# EAGLE board Zero_V1.0 (EAGLE 7.7.0)
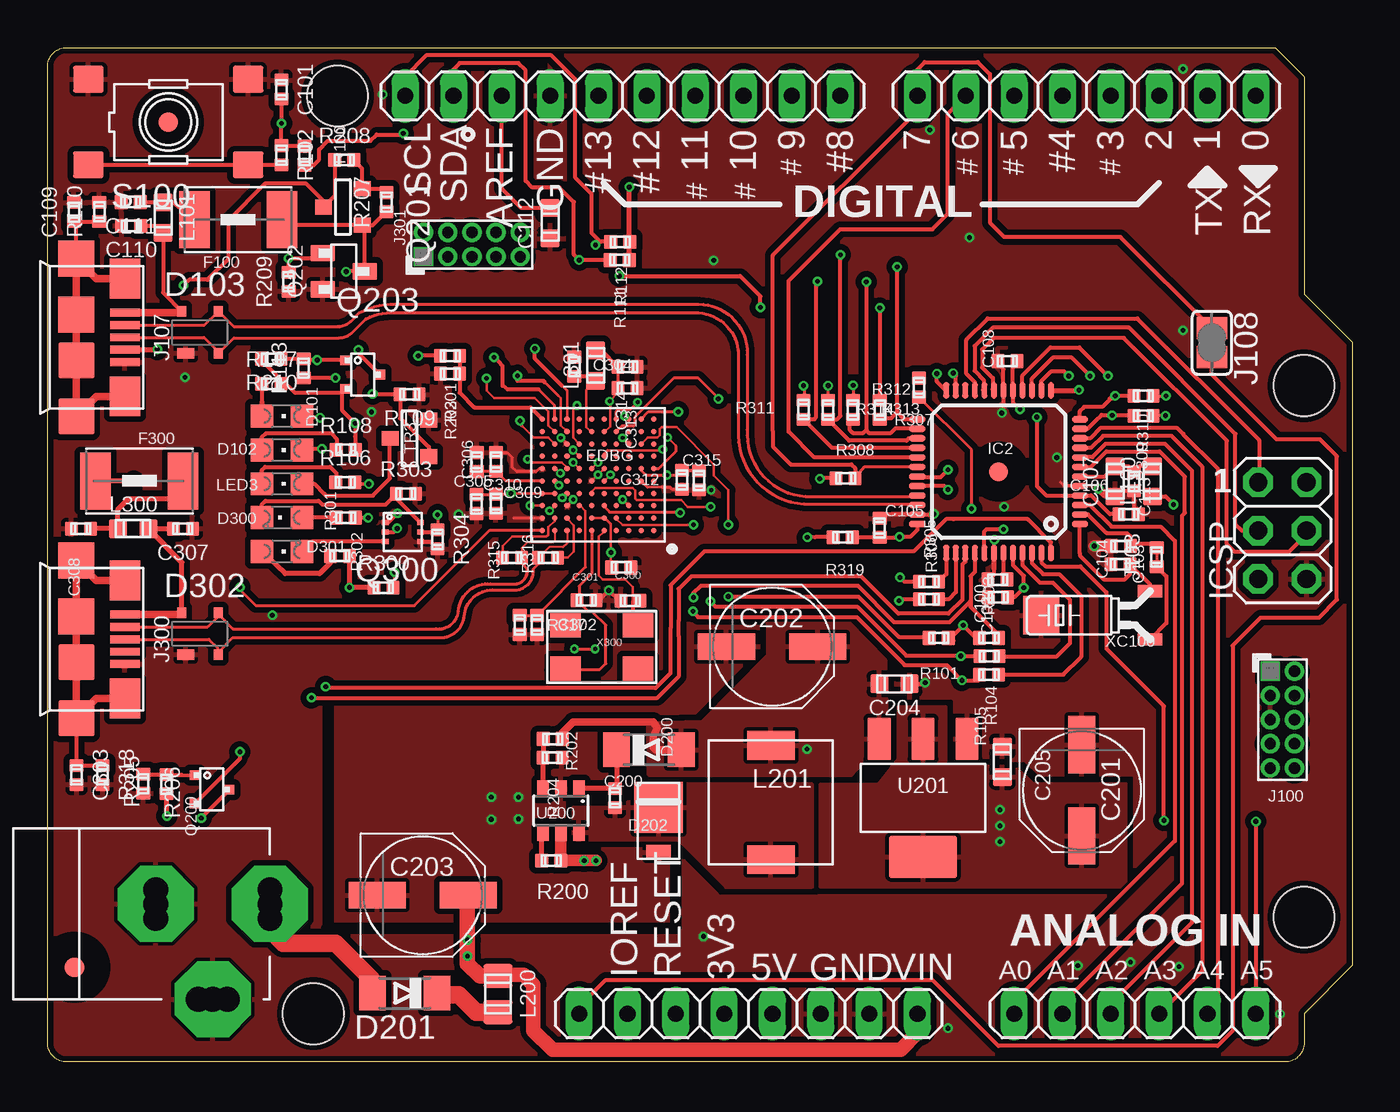
[diagram p3: board, top side]
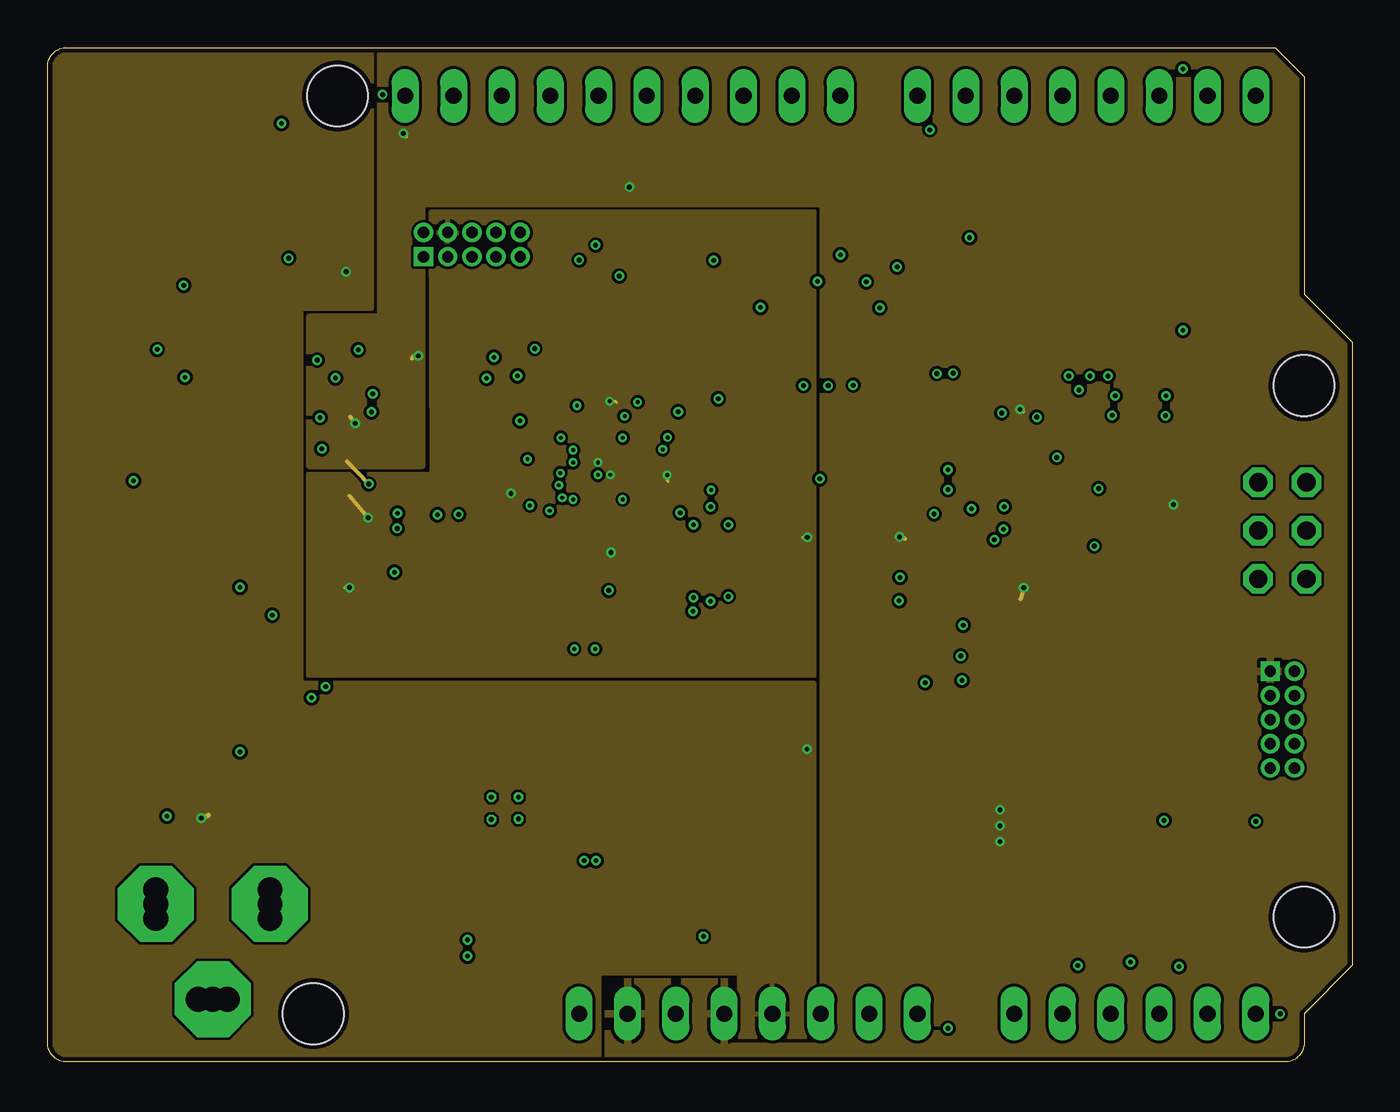
[diagram p4: board, inner layer Power]
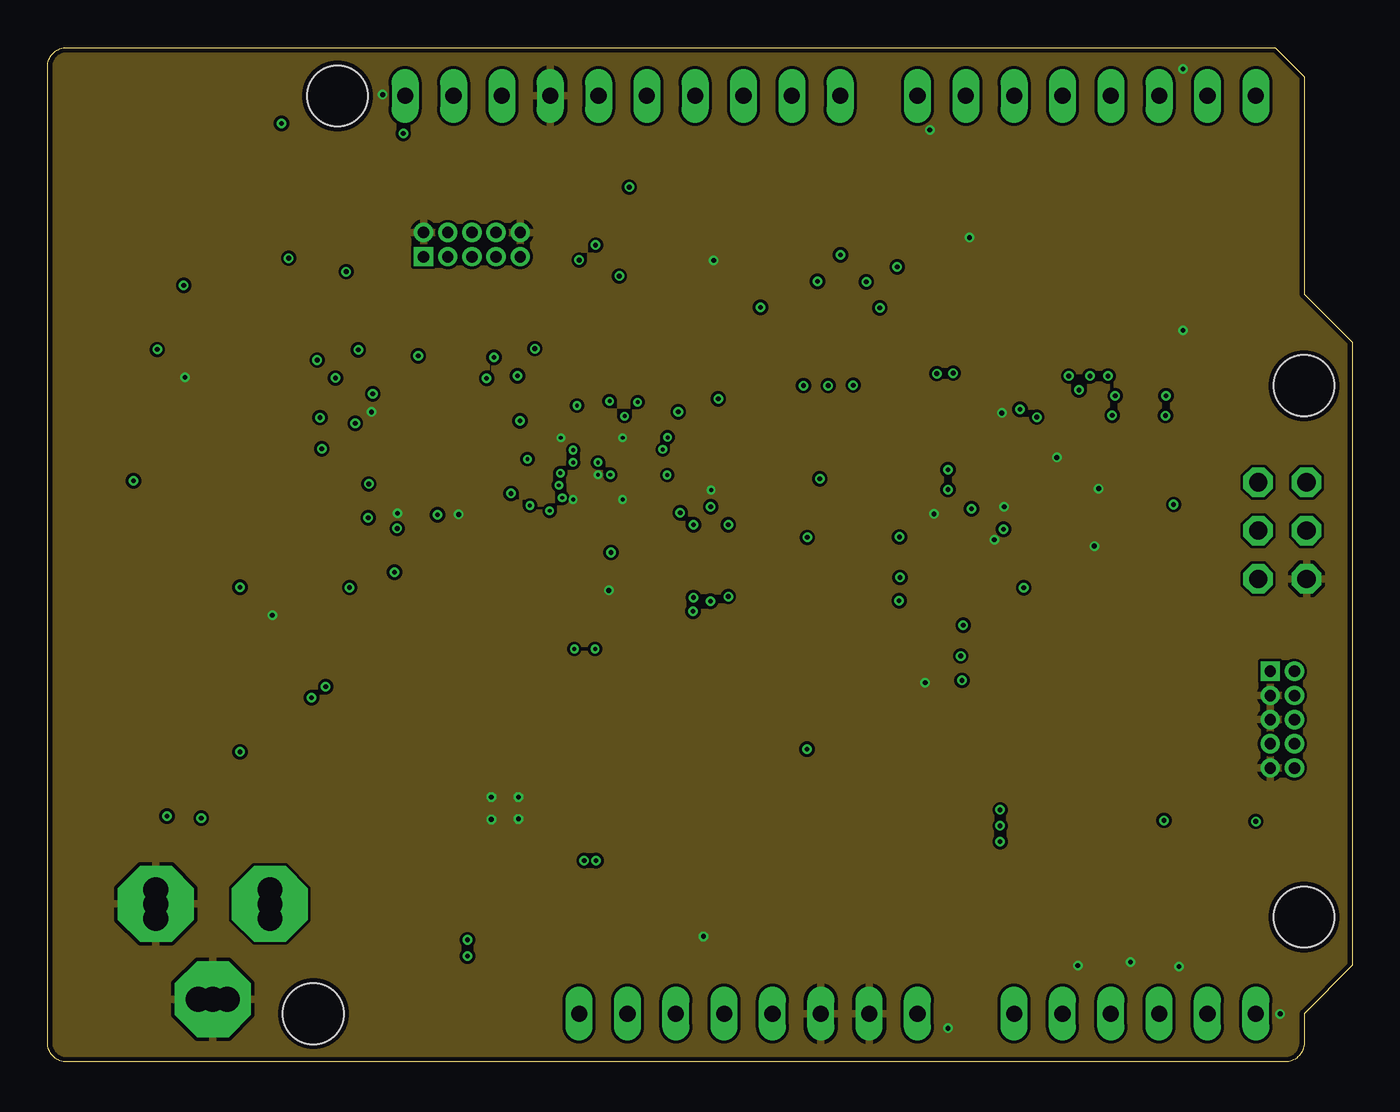
[diagram p5: board, inner layer GND]
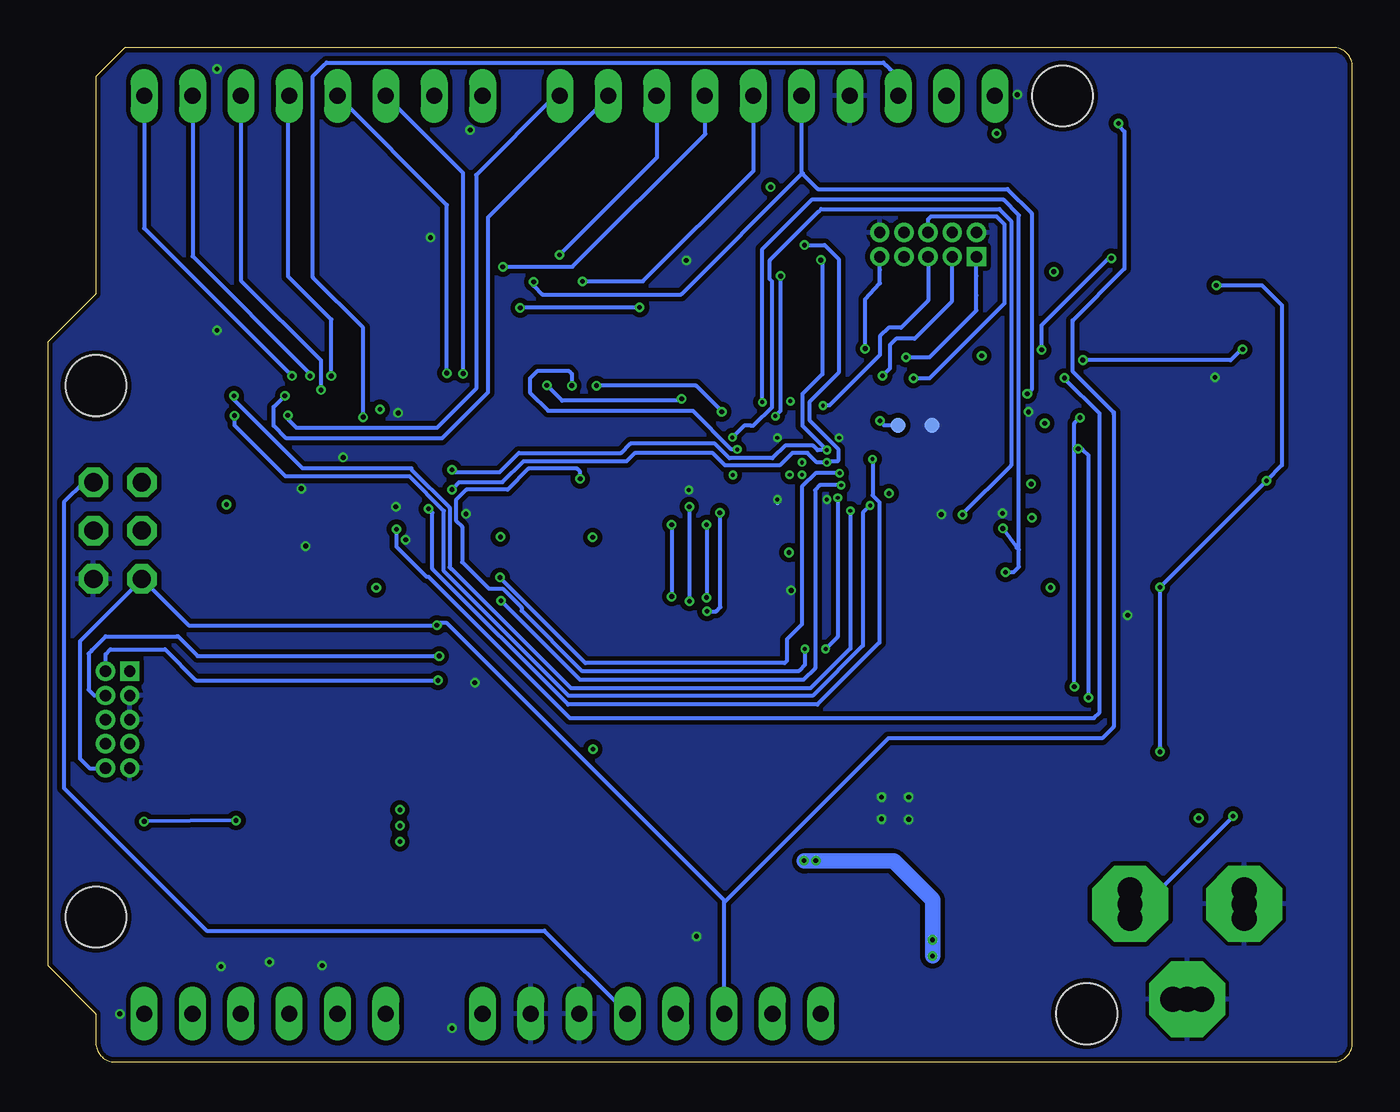
[diagram p6: board, bottom side, seen from below]

Size 68.58 x 53.34 mm. Coordinates in mm from the lower left corner, seen from the top.
Outline: 64.52,53.34 66.04,51.82 66.04,40.39 68.58,37.85 68.58,5.08 66.04,2.54 66.04,1 arc-90 65.04,0 1,0 arc-90 0,1 0,52.34 arc-90 1,53.34 64.52,53.34
Copper layers (1+2*3+16): Top 0.035mm / dielectric 0.36mm / Power 0.035mm / dielectric 0.71mm / Route3 0.035mm / dielectric 0.36mm / Bottom 0.035mm
Design rules "eC_4Layer_PClass6_BaseCopperO35-I35 *": minimum track width 0.1mm, minimum drill 0.2mm, track to track 0.15mm, track to pad 0.15mm, pad to pad 0.15mm, via to via 0.15mm, smd to smd 0mil, copper to edge 0.25mm, drill to drill 0.35mm, minimum pad ring 0.175mm, minimum via ring 0.125mm, stop-mask expansion 0mil, vias tented up to drill 0.45mm, thermal gap 0.2mm
Net classes: 0 default: width 0.102 mm, drill 0.1 mm; 1 USB: width 0.102 mm, drill 0.1 mm; 2 gnd: width 0.102 mm, drill 0.1 mm; 3 usbvcc: width 0.102 mm, drill 0.1 mm, clearance 0.15 mm; 4 USBpair: width 0.102 mm, drill 0.1 mm, clearance 0.15 mm to class 3
Holes 3.2 mm at 66.04,35.56 66.04,7.62 15.24,50.8 13.97,2.54
tKeepout: 2 lines
tRestrict: 3 lines

## Footprints (pad centres in the part's own frame; a part is rotated, then mirrored left to right if it is on the bottom)
C0402 = smd 0.75 x 0.7: 1 0,0.5; 2 0,-0.5
C0603 = smd 1 x 0.95: 1 0,0.8; 2 0,-0.8
PANASONIC_D = smd 3 x 1.4: + 2.4,0; - -2.4,0
CHIPLED_0805 = smd 1.2 x 1.2: A 0,-1.05; C 0,1.05
SOT143B = smd 0.88 x 0.55: 1 -0.75,-1.1 | smd 0.48 x 0.55: 2 0.95,-1.1; 3 0.95,1.1; 4 -0.95,1.1
MINIMELF = smd 1.4 x 1.8: A 1.7,0; C -1.7,0
DO220AAL = smd 2.667 x 2.54: P$1 -0.7,0 | smd 0.762 x 1.27: P$2 1.65,0
VFBGA100 = smd 0.28 x 0.28: A1 -2.925,2.925; A2 -2.275,2.925; A3 -1.625,2.925; A4 -0.975,2.925; A5 -0.325,2.925; A6 0.325,2.925; A7 0.975,2.925; A8 1.625,2.925; A9 2.275,2.925; A10 2.925,2.925; B1 -2.925,2.275; B2 -2.275,2.275; B3 -1.625,2.275; B4 -0.975,2.275; B5 -0.325,2.275; B6 0.325,2.275; B7 0.975,2.275; B8 1.625,2.275; B9 2.275,2.275; B10 2.925,2.275; C1 -2.925,1.625; C2 -2.275,1.625; C3 -1.625,1.625; C4 -0.975,1.625; C5 -0.325,1.625; C6 0.325,1.625; C7 0.975,1.625; C8 1.625,1.625; C9 2.275,1.625; C10 2.925,1.625; D1 -2.925,0.975; D2 -2.275,0.975; D3 -1.625,0.975; D4 -0.975,0.975; D5 -0.325,0.975; D6 0.325,0.975; D7 0.975,0.975; D8 1.625,0.975; D9 2.275,0.975; D10 2.925,0.975; E1 -2.925,0.325; E2 -2.275,0.325; E3 -1.625,0.325; E4 -0.975,0.325; E5 -0.325,0.325; E6 0.325,0.325; E7 0.975,0.325; E8 1.625,0.325; E9 2.275,0.325; E10 2.925,0.325; F1 -2.925,-0.325; F2 -2.275,-0.325; F3 -1.625,-0.325; F4 -0.975,-0.325; F5 -0.325,-0.325; F6 0.325,-0.325; F7 0.975,-0.325; F8 1.625,-0.325; F9 2.275,-0.325; F10 2.925,-0.325; G1 -2.925,-0.975; G2 -2.275,-0.975; G3 -1.625,-0.975; G4 -0.975,-0.975; G5 -0.325,-0.975; G6 0.325,-0.975; G7 0.975,-0.975; G8 1.625,-0.975; G9 2.275,-0.975; G10 2.925,-0.975; H1 -2.925,-1.625; H2 -2.275,-1.625; H3 -1.625,-1.625; H4 -0.975,-1.625; H5 -0.325,-1.625; H6 0.325,-1.625; H7 0.975,-1.625; H8 1.625,-1.625; H9 2.275,-1.625; H10 2.925,-1.625; J1 -2.925,-2.275; J2 -2.275,-2.275; J3 -1.625,-2.275; J4 -0.975,-2.275; J5 -0.325,-2.275; J6 0.325,-2.275; J7 0.975,-2.275; J8 1.625,-2.275; J9 2.275,-2.275; J10 2.925,-2.275; K1 -2.925,-2.925; K2 -2.275,-2.925; K3 -1.625,-2.925; K4 -0.975,-2.925; K5 -0.325,-2.925; K6 0.325,-2.925; K7 0.975,-2.925; K8 1.625,-2.925; K9 2.275,-2.925; K10 2.925,-2.925
WUERTH-ELEKTRONIK_1812 = smd 1.6 x 3: 1 -2.3,0; 2 2.3,0
FIDUCIA-MOUNT = smd 1.016 x 1.016: P$1 0,0
TQFP48 = smd 0.85 x 0.32: 1 -4.275,2.75; 2 -4.275,2.25; 3 -4.275,1.75; 4 -4.275,1.25; 5 -4.275,0.75; 6 -4.275,0.25; 7 -4.275,-0.25; 8 -4.275,-0.75; 9 -4.275,-1.25; 10 -4.275,-1.75; 11 -4.275,-2.25; 12 -4.275,-2.75; 25 4.275,-2.75; 26 4.275,-2.25; 27 4.275,-1.75; 28 4.275,-1.25; 29 4.275,-0.75; 30 4.275,-0.25; 31 4.275,0.25; 32 4.275,0.75; 33 4.275,1.25; 34 4.275,1.75; 35 4.275,2.25; 36 4.275,2.75 | smd 0.32 x 0.85: 13 -2.75,-4.275; 14 -2.25,-4.275; 15 -1.75,-4.275; 16 -1.25,-4.275; 17 -0.75,-4.275; 18 -0.25,-4.275; 19 0.25,-4.275; 20 0.75,-4.275; 21 1.25,-4.275; 22 1.75,-4.275; 23 2.25,-4.275; 24 2.75,-4.275; 37 2.75,4.275; 38 2.25,4.275; 39 1.75,4.275; 40 1.25,4.275; 41 0.75,4.275; 42 0.25,4.275; 43 -0.25,4.275; 44 -0.75,4.275; 45 -1.25,4.275; 46 -1.75,4.275; 47 -2.25,4.275; 48 -2.75,4.275 | smd 1 x 1: P$1 0,0
2X03 = drill 0.95 pad 1.55 octagon: 1 -2.54,-1.27; 2 -2.54,1.27; 3 0,-1.27; 4 0,1.27; 5 2.54,-1.27; 6 2.54,1.27
PINHEAD_2X05_127 = drill 0.6 pad 1.016 square: 1 -0.635,2.54 | drill 0.6 pad 1.016: 2 0.635,2.54; 3 -0.635,1.27; 4 0.635,1.27; 5 -0.635,0; 6 0.635,0; 7 -0.635,-1.27; 8 0.635,-1.27; 9 -0.635,-2.54; 10 0.635,-2.54
1X10 = drill 0.85 pad 1.422 long: 1 -11.43,0; 2 -8.89,0; 3 -6.35,0; 4 -3.81,0; 5 -1.27,0; 6 1.27,0; 7 3.81,0; 8 6.35,0; 9 8.89,0; 10 11.43,0
1X08 = drill 0.85 pad 1.422 long: 1 -8.89,0; 2 -6.35,0; 3 -3.81,0; 4 -1.27,0; 5 1.27,0; 6 3.81,0; 7 6.35,0; 8 8.89,0
1X06 = drill 0.85 pad 1.422 long: 1 -6.35,0; 2 -3.81,0; 3 -1.27,0; 4 1.27,0; 5 3.81,0; 6 6.35,0
USB-MICRO-10103594 = smd 0.4 x 1.6: D+ 0,0; D- -0.65,0; GND 1.3,0; ID 0.65,0; VBUS -1.3,0 | smd 1.9 x 1.9: SHLD1 -1.2,-2.55; SHLD2 1.2,-2.55; SHLD3 -4.15,-2.55; SHLD4 4.15,-2.55 | smd 2.1 x 1.6: SHLD5 3.1,0; SHLD6 -3.1,0
SJ = smd 1.168 x 1.6: 1 -0.762,0; 2 0.762,0
POWERSUPPLY_DC-21MM = drill 1.3 pad 4 octagon: 1 -5.08,-3.353; 2 -0.076,-6.35; 3 -0.076,-0.356 | drill 1.3: 4 -5.08,-4.115; 5 -5.08,-2.591; 6 -0.838,-0.356; 7 0.686,-0.356; 8 -0.838,-6.35; 9 0.686,-6.35
C0805 = smd 1.5 x 1.25: 1 0,0.95; 2 0,-0.95
SRR0604 = smd 1.5 x 2.5: P$1 3,0; P$2 -3,0
SOT323 = smd 0.6 x 0.5: 1 -0.9,0.75; 2 0.9,0; 3 -0.9,-0.75
SOT-23 = smd 0.787 x 0.889: 1 0.025,-1.016; 2 -0.94,1.016; 3 0.991,1.016
SOT23 = smd 1.3 x 0.9: 1 -1.1,0.95; 2 -1.1,-0.95; 3 1.1,0
PWR_SC70-6L2 = smd 0.25 x 0.35: 1 -0.5,-0.925; 2 0,-0.925; 3 0.5,-0.925; 4 0.5,0.925; 5 0,0.925; 6 -0.5,0.925
TS42_4PINS = smd 1.6 x 1.4: 1 -4.2,2.25; 2 4.2,2.25; 3 -4.2,-2.25; 4 4.2,-2.25
TP-SP = smd 0.8 x 0.8 bottom: X 0,0
SOT23-6 = smd 0.6 x 0.9: 1 -0.95,-1.15; 2 0,-1.15; 3 0.95,-1.15; 4 0.95,1.15; 5 0,1.15; 6 -0.95,1.15
SOT223 = smd 2.235 x 1.219: 1 -3.099,2.311; 2 -3.099,0; 3 -3.099,-2.311 | smd 2.2 x 3.6: 4 3.099,0
CRYSTAL-5.4-3.2 = smd 1.6 x 1.3: 1 -1.9,-1.15; 2 1.9,-1.15; 3 1.9,1.15; 4 -1.9,1.15
CRYSTAL_TC26SMD = smd 1.27 x 0.635: 1 0,1.27; 2 0,-1.27 | smd 1.905 x 2.032: P$1 5.715,0

## Placement (x,y rotation side)
C100  100nF  [C0402]  49.96,24.43 270 top
C101  100nF  [C0402]  12.29,51.13 180 top
C102  100nF  [C0402]  49.93,25.37 270 top
C103  6.8pF  [C0402]  56.39,26.16 90 top
C104  6.8pF  [C0402]  56.41,27.13 90 top
C105  100nF  [C0402]  43.74,28.08 180 top
C106  100nF  [C0402]  57.1,30.53 0 top
C107  10uF  [C0603]  56.11,30.53 0 top
C108  100nF  [C0402]  50.44,36.85 90 top
C109  DNP  [C0402]  1.38,44.7 0 top
C110  4.7nF  [C0402]  4.39,43.97 90 top
C111  4.7nF  [C0402]  4.37,45.21 90 top
C112  4.7uF  [C0603]  26.42,44.1 0 top
C113  100nF  [C0402]  56.82,28.8 90 top
C200  10n  [C0402]  29.82,13.88 0 top
C201  10uF  [PANASONIC_D]  54.36,14.28 270 top
C202  47u  [PANASONIC_D]  38.08,21.84 0 top
C203  10uF  [PANASONIC_D]  19.72,8.77 0 top
C204  4.7uF  [C0603]  44.51,19.88 90 top
C205  4.7uF  [C0603]  50.18,15.79 0 top
C300  22pF  [C0402]  30.63,24.26 270 top
C301  22pF  [C0402]  28.32,24.28 90 top
C302  10pF  [C0402]  25.73,22.98 0 top
C303  DNP  [C0402]  1.52,15.09 180 top
C304  100nF  [C0402]  27.68,36.56 180 top
C305  1uF  [C0402]  22.55,31.54 180 top
C306  1nF  [C0402]  23.57,31.55 180 top
C307  1nF  [C0402]  7.11,28.04 90 top
C308  1nF  [C0402]  1.75,28.04 270 top
C309  100nF  [C0402]  22.55,29.34 0 top
C310  1uF  [C0402]  23.56,29.36 0 top
C311  100nF  [C0402]  30.15,26 90 top
C312  100nF  [C0402]  33.35,30.61 0 top
C313  100nF  [C0402]  30.48,35.43 90 top
C314  2.2uF  [C0402]  30.48,36.55 90 top
C315  2.2uF  [C0402]  34.24,30.58 0 top
D101  Yellow  [CHIPLED_0805]  12.32,33.96 270 top
D102  Yellow  [CHIPLED_0805]  12.32,32.18 270 top
D103  PRTR5V0U2XB  [SOT143B]  8.01,38.37 0 top
D200  CD1206-S01575  [MINIMELF]  31.61,16.42 0 top
D201  BYS10-45-E3  [MINIMELF]  18.77,3.62 180 top
D202  SS1P3L  [DO220AAL]  32.11,12.68 270 top
D300  Green  [CHIPLED_0805]  12.32,28.63 90 top
D301  Yellow  [CHIPLED_0805]  12.32,26.85 270 top
D302  PRTR5V0U2XB  [SOT143B]  8.01,22.53 0 top
EDBG  [VFBGA100]  28.93,30.88 180 top
F100  MF-MSMF050-2  [WUERTH-ELEKTRONIK_1812]  10.01,44.29 0 top
F300  [WUERTH-ELEKTRONIK_1812]  4.83,30.56 180 top
FD1  FIDUCIALMOUNT  [FIDUCIA-MOUNT]  6.35,49.41 0 top
FD2  FIDUCIALMOUNT  [FIDUCIA-MOUNT]  1.42,4.98 0 top
IC2  SAMD21G18A-AUT  [TQFP48]  49.99,31.04 180 top
ICSP  3x2 M  [2X03]  64.9,27.94 270 top
J100  PINHEAD-2x5-P1.27  [PINHEAD_2X05_127]  64.9,18 0 top
J101  FH254-110DF08500V  [1X10]  30.23,50.8 180 top
J102  FH254-108DF08500V  [1X08]  54.61,50.8 180 top
J103  [C0402]  58.29,26.54 0 top
J105  FH254-108DF08500V  [1X08]  36.83,2.54 0 top
J106  FH254-106DF08500V  [1X06]  57.15,2.54 0 top
J107  ZX62-AB-5PA  [USB-MICRO-10103594]  4.06,38.1 270 top
J108  [SJ]  61.19,37.82 270 top
J200  POWER-SUPPLY  [POWERSUPPLY_DC-21MM]  5.33,8.38 90 top
J300  ZX62-AB-5PA  [USB-MICRO-10103594]  4.06,22.23 270 top
J301  PINHEAD-2x5-P1.27  [PINHEAD_2X05_127]  22.3,42.98 90 top
L100  BLM18PG471SN1  [C0603]  58.06,30.53 0 top
L101  BLM18PG471SN1  [C0603]  6.07,44.4 180 top
L200  MH2029-300Y  [C0805]  23.67,3.57 180 top
L201  10uH-SRR0604-100ML  [SRR0604]  38.01,13.65 270 top
L300  BLM18PG471SN1  [C0603]  4.5,28.04 270 top
L301  BLM18PG471SN1  [C0603]  28.8,36.63 0 top
LED3  Yellow  [CHIPLED_0805]  12.32,30.4 270 top
Q200  IRLML6402PBF  [SOT323]  8.64,14.33 0 top
Q201  IRLML6402PBF  [SOT-23]  15.52,44.98 270 top
Q202  2N7002  [SOT23]  15.57,41.58 0 top
Q203  IRLML6402PBF  [SOT323]  16.56,36.14 0 top
Q300  2N7002DW-7-FNO_PAD  [PWR_SC70-6L2]  18.67,27.86 270 top
R100  10k  [C0402]  13.51,47.65 0 top
R101  330R  [C0402]  46.84,22.3 90 top
R102  39R  [C0402]  12.29,47.68 180 top
R103  330R  [C0402]  49.48,22.3 270 top
R104  0R  [C0402]  49.5,21.33 270 top
R105  0R  [C0402]  49.48,20.37 90 top
R106  330R  [C0402]  15.64,30.48 270 top
R107  330R  [C0402]  11.76,35.66 270 top
R108  330R  [C0402]  15.67,32.18 270 top
R109  330R  [C0402]  19.02,35.1 90 top
R110  DNP  [C0402]  2.72,44.7 0 top
R111  DNP  [C0402]  30.07,42.16 90 top
R112  DNP  [C0402]  30.1,43.13 90 top
R113  330R  [C0402]  13.46,36.47 0 top
R200  10k  [C0402]  26.47,10.6 270 top
R201  47k  [C0402]  21.16,37.13 270 top
R202  52.3k  [C0402]  26.55,16.98 270 top
R203  47k  [C0402]  21.16,36.2 90 top
R204  10k  [C0402]  26.53,15.99 90 top
R205  100k  [C0402]  6.25,14.6 0 top
R206  100k  [C0402]  5.03,14.63 180 top
R207  1M  [C0402]  17.81,45.21 0 top
R208  DNP  [C0402]  15.6,47.42 270 top
R209  100k  [C0402]  12.67,41.02 0 top
R210  100k  [C0402]  11.76,36.98 90 top
R300  1M  [C0402]  17.65,24.94 270 top
R301  330R  [C0402]  15.67,28.63 90 top
R302  330R  [C0402]  15.37,26.61 90 top
R303  DNP  [C0402]  18.83,29.88 270 top
R304  1M  [C0402]  20.5,27.48 180 top
R305  330R  [C0402]  46.33,25.24 270 top
R306  330R  [C0402]  46.33,24.33 270 top
R307  330R  [C0402]  45.8,35.46 0 top
R308  330R  [C0402]  41.95,30.7 270 top
R309  330R  [C0402]  57.59,33.99 90 top
R310  330R  [C0402]  57.59,35.03 90 top
R311  330R  [C0402]  39.73,34.3 0 top
R312  330R  [C0402]  43.74,34.29 0 top
R313  330R  [C0402]  42.34,34.29 0 top
R314  330R  [C0402]  41.02,34.28 0 top
R315  39R  [C0402]  24.4,26.51 270 top
R316  39R  [C0402]  26.3,26.51 90 top
R317  6.8k  [C0402]  24.82,22.98 180 top
R318  DNP  [C0402]  2.9,15.09 180 top
R319  0R  [C0402]  41.79,27.59 270 top
S100  PUSHBUTTON3  [TS42_4PINS]  6.34,49.42 0 top
TP300  TP_SP  [TP-SP]  22.1,33.49 0 top
TP301  TP_SP  [TP-SP]  23.88,33.49 0 top
TR3  Q100  [SOT-23]  19.02,32.82 270 top
U200  LM2734Y  [SOT23-6]  26.98,13.22 180 top
U201  LDO-TS1117CW-3V3  [SOT223]  46.01,13.89 270 top
U$5  DNP  [FRAME]  -32.23,-4.98 0 top  (outside the outline)
X300  12mHz-12pF-K7  [CRYSTAL-5.4-3.2]  29.13,21.82 0 top
XC100  32.768kHz  [CRYSTAL_TC26SMD]  57.94,23.48 180 top

## Tracks (layer width: path | path; a pad name or v marks a point on that pad's centre or on a via)
+3V3  (via drill 0.25 pad 0.45)
  Top 0.2: C100.1 50.82,24.45
  Top 0.203: C108.2 50.74,36.49 IC2.17 50.74,34.68 v51.1,34.31 | 59.04,29.3 v59.18,29.31 58.76,29.73 L100.2 | R108.1 16.17,32.91 v16.17,33.58 15.47,34.28 15.47,35.2 | 15.66,35.34 Q203.3 15.47,35.2 | R100.2 13.98,47.15 14.28,47.45 14.28,47.98 14.73,48.44 16.97,48.44 17.3,48.77 18.64,48.77 v18.69,48.82 | R201.2 v19.48,37.13 | IC2.36 45.71,27.98 45.34,27.61 v44.78,27.61 44.75,27.58 C105.1 R319.1 | R210.1 11.26,36.66 11.47,36.66 12.26,35.87 R107.1 12.27,35.92 12.98,35.2 15.47,35.2 | 50.82,24.45 v51.31,24.94 51.31,25.56 50.74,26.13 IC2.44 | R106.1 16.17,30.4 v16.88,30.39
  Top 0.254: 30.57,43.1 v30.57,46 | R111.2 30.57,43.1 | 30.57,43.1 R112.2
  Power 0.203: v59.18,29.31 59.11,29.31 59.13,29.29 | v51.31,24.94 51.16,24.36 51.13,24.33 | v16.88,30.39 15.75,31.57 | v16.17,33.58 15.9,33.93 15.95,33.88 | v18.69,48.82 18.85,48.67 | v19.48,37.13 19.28,37.13 19.15,37.01 | v51.1,34.31 51.16,34.31 51.26,34.21 | v44.78,27.61 44.96,27.61 45.06,27.51
  Bottom 0.203: J100.1
  other vias: 50.06,11.58 50.06,12.42 50.06,13.26
  pour Top: 47.19,18.65 44.72,18.65 44.72,15.92 43.67,14.6 40.62,14.57 40.62,9.22 56.38,9.2 56.68,9.2 56.68,14.6 56.4,14.6 51.77,14.62 50.87,15.52 47.22,15.52
  pour Power: 17.52,54.47 17.52,39.17 13.77,39.17 13.77,31.37 19.67,31.37 19.67,45.12 40.77,45.12 40.77,0.82 35.92,0.82 35.92,4.22 29.47,4.22 29.47,-1.23 70.12,-1.23 70.12,54.47
+5V  (via drill 0.25 pad 0.45)
  Top 0.203: Q201.3 17.09,43.99 R207.2 | Q201.3 16.67,43.86 Q202.3 15.72,41.58 v15.7,41.55 | Q201.3 12.61,43.99 F100.2 | 9.45,14.33 9.45,14.2 v8.08,12.83
  Top 0.254: Q200.2 9.45,14.33
  Top 0.406: R202.1 27.05,17.3 27.62,17.87 31.84,17.87 32.04,17.57 31.84,17.12 31.84,16.55 31.98,16.42 D200.A
  Power 0.203: v15.7,41.55 15.54,41.55 15.52,41.58
  Power 0.254: v8.08,12.83 8.43,12.95 8.46,12.98
  Bottom 0.203: ICSP.2 66.67,30.48 67.72,29.44 67.72,14.4 60.22,6.91 42.47,6.91 J105.5
  other vias: 39.92,16.45
  pour Power: 40.27,1.32 36.37,1.32 36.37,4.67 28.97,4.67 28.97,-0.53 -0.93,-0.53 -0.93,54.32 17.02,54.32 17.02,39.62 13.32,39.62 13.32,19.92 40.27,19.92
  pour Top: 31.6,15.13 42.22,15.1 43.57,16.63 44.09,16.61 44.09,17.15 44.02,21.11 42.03,23.15 37.84,23.15 37.89,22.75 37.89,21.36 34.42,17.84 31.57,17.77
ATN
  Top 0.2: 62.28,1.88 62.28,1.64
  Top 0.203: J105.1 27.94,2.92 29.34,4.32 46.51,4.32 49.98,0.85 61.49,0.85 62.28,1.64 | J108.2 61.19,36.14 64.59,32.74 66.88,32.74 67.77,31.85 67.77,24.31 66.83,23.37 63.75,23.37 62.28,21.89 62.28,1.88
BD_N
  Top 0.102: R315.1 24.92,26.53 24.92,27.02 25.22,27.32 26.57,27.32 26.65,27.4 EDBG.A9 | D302.3 8.96,23.55 8.96,23.42
  Top 0.152: 24.94,26.55 R315.1 | 24.9,26.25 25.21,25.93 arc-90 24.66,25.14 23.27,25.14 arc90 21.59,23.7 arc-90 20.41,22.77 9.74,22.77 8.96,23.55 | J300.D- 8.42,22.88 8.96,23.42
  Top 0.203: R315.1 24.9,26.25
BD_P
  Top 0.102: 8.96,21.54 8.96,21.74 | EDBG.A8 27.3,27.27 27.1,27.07 26.37,27.07 R316.1
  Top 0.152: 25.8,26.21 25.53,25.93 arc-90 24.66,24.82 23.52,24.82 arc90 21.89,23.44 arc-90 20.52,22.32 9.74,22.32 8.96,21.54 | J300.D+ 8.47,22.23 8.96,21.74
  Top 0.203: D302.2 8.96,21.54 | R316.1 25.8,26.21
BOOST
  Top 0.254: D200.C 29.91,14.38 C200.1 27.94,14.38 U200.1
DGI_GPIO1
  Top 0.152: IC2.30 42.94,31.29 R308.1
  Top 0.2: 38.12,42.41 45.43,49.72 45.62,49.91 | 38.12,33.17 38.12,32.37 39.07,31.42 42.24,31.42 42.44,31.22 R308.1
  Top 0.203: 38.12,33.17 38.12,42.41 | J108.1 56.39,43.38 50.29,43.38 49.53,44.14 49.53,51.94 48.9,52.58 46.1,52.58 45.63,52.11 45.63,50.89 J102.8 45.72,50.01 45.43,49.72
  Top 0.254: 42.44,30.8 R308.1
DGI_GPIO2  (via drill 0.25 pad 0.45)
  Top 0.203: IC2.11 54.65,33.29 55.09,33.73 55.1,33.73 55.39,34.02 55.94,34.02 v55.96,34.01 55.98,33.98 R309.1
  Bottom 0.203: J101.1 41.88,50.8 46.05,46.63 46.05,35.41 48.11,33.35 55.5,33.35 55.96,33.81 v55.96,34.01
DGI_GPIO3  (via drill 0.25 pad 0.45)
  Top 0.203: IC2.12 54.26,34.22 54.48,34.44 55.42,34.44 55.84,34.86 | R310.1 v56.11,35.03
  Top 0.254: v56.11,35.03 56.01,35.03 55.84,34.86
  Bottom 0.203: J101.2 39.12,50.72 45.44,44.4 45.44,35.2 47.85,32.79 56.03,32.79 56.69,33.45 56.69,34.44 v56.11,35.03
EDBG_ADC0
  Top 0.203: R201.1 R203.2 21.66,35.19 22.43,34.42 25.38,34.42 EDBG.K10
EDBG_FORCE_BOOT  (via drill 0.25 pad 0.45)
  Top 0.125: EDBG.H9 26.32,32.82 25.56,32.82 24.94,33.45
  Top 0.152: v24.83,33.71 24.83,33.56 24.94,33.45
  Bottom 0.203: v24.83,33.71 24.61,33.49 TP301.X
EDBG_JTAG_TCK  (via drill 0.25 pad 0.45)
  Top 0.152: EDBG.K9 26.65,34.52 25.8,35.36
  Top 0.203: 25.8,35.36 24.18,35.36 23.92,35.55 23.92,36.59 23.53,37.05 v23.46,37.05
  Bottom 0.203: 19.76,40.3 19.76,41.34 | 19.76,41.34 J301.1 | 19.76,41.34 19.76,39.52 22.23,37.05 v23.46,37.05
EDBG_JTAG_TDI  (via drill 0.25 pad 0.45)
  Top 0.125: EDBG.K8 27.3,35.29
  Top 0.152: 27.3,35.29 26.66,35.93
  Top 0.203: 27.04,35.55 26.66,35.93 25.61,36.98 v25.61,37.5
  Bottom 0.203: 24.83,42.33 J301.9 24.84,41.65 24.83,40.95 25.61,40.1 v25.61,37.5
EDBG_JTAG_TDO  (via drill 0.25 pad 0.45)
  Top 0.125: 27.23,33.21 26.98,33.47 26.98,34.9
  Top 0.127: 26.85,35.03 26.98,34.9 | 26.98,33.47 EDBG.J8
  Top 0.152: 26.13,35.75 26.85,35.03 | EDBG.J8 27.3,33.21 27.23,33.21 EDBG.J8
  Top 0.203: 26.13,35.75 26.07,35.81 24.7,35.81 24.57,36.01 24.7,36.27 v24.7,36.07
  Bottom 0.203: J301.3 21,42.31 21.06,42.24 21.06,39.97 23.01,38.02 23.98,38.02 24.31,37.7 24.31,36.46 v24.7,36.07
EDBG_JTAG_TMS  (via drill 0.2 pad 0.45)
  Top 0.125: EDBG.H7 27.62,32.82 27.62,34.32 v27.82,34.52
  Bottom 0.203: J301.5 22.29,40.04 23.73,38.61 24.38,38.61 24.83,38.15 24.83,37.18 27.5,34.52 v27.82,34.52
EDBG_RESET_N  (via drill 0.25 pad 0.45)
  Top 0.125: EDBG.J9 26.32,33.47 26.32,34.19 25.61,34.9 23.46,34.9 23.07,35.29 v23.07,35.95
  Bottom 0.203: J301.6 22.3,44.32 22.14,44.47 18.72,44.47 18.29,44.05 18.29,39.88 22.23,35.95 v23.07,35.95
EN
  Top 0.254: R200.2 25.97,12.01 U200.4
FB
  Top 0.254: R202.2 26.05,16.01 R204.1 U200.3
GND  (via drill 0.2 pad 0.4, 0.2 pad 0.45, 0.25, 0.25 pad 0.45)
  Top 0.125: EDBG.E6 v28.93,30.88 EDBG.F5 | 24.5,28.6 EDBG.B10
  Top 0.127: EDBG.C3 v30.23,29.58 | 31.52,30.23 32.3,30.23
  Top 0.152: EDBG.H8 v26.98,32.82 | EDBG.H3 v30.23,32.82 | EDBG.E2 31.52,30.23 | 32.3,30.23 32.7,30.23 32.81,30.11 C312.2 | EDBG.C8 v27.62,29.58 | EDBG.F10 25.84,31.2 25.68,31.04 24.66,31.04 24.43,31.27 24.43,31.78 24.18,32.03 23.59,32.03 C306.2 | IC2.5 53.43,30.29 53.24,30.48 | IC2.42 49.74,27.44 v49.76,27.46 | U201.1 48.23,17.84
  Top 0.2: IC2.35 46.57,28.79 v46.59,28.82 | 49.74,25.62 C102.2
  Top 0.203: C108.1 50.24,36.41 IC2.18 50.24,34.22 | 50.24,34.22 50.24,34.21 | IC2.35 43.94,28.79 C105.2 | C204.2 46.07,19.88 | C300.2 30.04,24.26 v29.5,24.8 28.99,24.28 C301.2 | 49.74,25.95 49.74,25.62 | C113.2 57.1,29.03 C106.2 56.41,30.03 C107.2 56.01,29.83 55.56,29.83 | 50.24,34.22 50.24,34.21 v50.15,34.12 | Q300.1 17.9,28.36 v18.39,28.86 | Q300.4 20.12,27.36 R304.1
  Top 0.254: IC2.18 | IC2.5 | IC2.42 49.74,25.95
  Top 0.406: 55.56,29.83 v55.24,30.15
  Top 0.61: C104.1 55.14,27.13 v55.02,27.13
  Bottom 0.203: v30.23,29.58 30.23,29.38
  other vias: 34.47,6.6 53.05,31.79 46.37,49.01 48.45,43.35 7.22,36 17.03,34.18 46.13,19.94 59.68,38.47 17.61,50.86 21.61,28.79 64.78,2.53 47.33,1.78 50.28,29.2 35.01,42.15 11.81,23.5 24.75,13.93 24.75,12.78 23.32,12.75 23.32,13.93 54.14,5.07 56.92,5.25 59.47,5.02 59.68,52.22 34.88,30.08
  pour Bottom (isolate 0.254, rank 2): -4.42,55.63 72.92,55.63 73.08,-2.64 -4.42,-2.9
  pour Top (isolate 0.305, rank 2): -3.02,55.04 71.88,55.04 71.88,-1.8 -3.02,-1.8
  pour GND: -5.52,-5.85 76.77,-5.85 76.77,56.1 76.77,56.62 -5.52,56.62 -5.52,56.42
MISO  (via drill 0.25 pad 0.45)
  Top 0.152: R311.2 40.02,33.8 | 40.39,41 v40.47,41.05
  Top 0.2: IC2.28 41.24,32.29 R311.2 40.3,33.8 40.39,33.92 40.39,41
  Bottom 0.203: 31.46,50.79 31.48,50.81 J101.5 31.47,50.77 31.47,46.86 37.29,41.05 v40.47,41.05
MOSI  (via drill 0.25 pad 0.45)
  Top 0.2: IC2.25 45.03,33.79 44.65,34.16 | 43.78,33.83 44.32,33.83 44.65,34.16 | 44.65,34.16 v44.65,41.81
  Top 0.203: 43.78,33.83 R312.2
  Bottom 0.203: v44.65,41.81 41,41.81 34.01,48.79 34.01,50.77 J101.4
N$1
  Top 0.203: Q300.6 18.33,29.63 R303.2 17.76,29.31 14.44,29.31 14.25,29.5 11.44,29.5 11.27,29.32 D300.C
N$2
  Top 0.203: 13.73,26.88 13.42,26.88 D301.C 13.89,27.36 Q300.3
N$3
  Top 0.203: 18.03,32.76 TR3.1 18,30.68 17.1,29.78 14.63,29.78 14.54,29.87 | LED3.C 14.01,30.4 14.54,29.87 | 14.54,29.87
N$4
  Top 0.203: 12.27,47.15 R102.1 S100.4 S100.3
N$5
  Top 0.203: R318.2 C303.2 J300.SHLD4
  Top 0.406: J300.SHLD6 2.56,25.33 J300.SHLD3 J300.SHLD1 J300.SHLD2 1.51,18.83 1.89,18.45 | J300.SHLD5 2.56,19.12 1.89,18.45 | 1.89,18.45 J300.SHLD4
N$6
  Top 0.203: R208.1 16.54,46.98 Q201.2 17.59,45.92 R207.1
N$7
  Top 0.203: C110.2 5.7,43.97 L101.1 6.07,40.46 D103.4
  Top 0.406: J107.VBUS 6.99,39.4 D103.4
N$8
  Top 0.914: L200.1 22.52,2.62 21.62,3.52 20.47,3.52 D201.C
N$9  (via drill 0.25 pad 0.45)
  Top 0.152: Q203.2 17.25,36.14
  Top 0.203: R209.1 v12.67,42.27 14.21,42.27 Q202.1 | v16.33,37.44 16.33,37.27 Q203.2
  Bottom 0.203: 12.75,42.27 v12.67,42.27 12.8,42.27 16.33,38.73 v16.33,37.44
N$10
  Top 0.203: 57.28,30.9 C106.1 | L100.1 57.4,31.33 C106.1 | C106.1 56.8,31.33 C107.1 55.56,30.79 IC2.6
N$11
  Top 0.203: J107.SHLD3 1.51,44.06 C109.2 R110.2
  Top 0.406: J107.SHLD6 2.56,41.2 J107.SHLD3 J107.SHLD1 J107.SHLD2 J107.SHLD4 2.56,35 J107.SHLD5
N$12
  Top 0.203: C111.2 L101.2 6.58,45.2 F100.1
N$13
  Top 0.254: F300.1 7.06,30.6 7.06,29.69 6.98,29.62 4.27,29.62 3.7,29.05 L300.2 C308.1
N$18
  Top 0.125: EDBG.B9 26.65,28.45 26.31,28.12 26.31,27.72 26.22,27.62 24.42,27.62 23.92,27.12 23.92,26.53 R315.2
  Top 0.152: 23.93,26.53 R315.2
N$19
  Top 0.125: 27.3,28.58 27.66,28.22 27.66,26.85 27.33,26.52 26.82,26.52
  Top 0.152: EDBG.B8 27.3,28.58 | 26.82,26.52 R316.2
N$20
  Top 0.203: D102.A 11.27,32.85 11.48,33.06 14.9,33.06 15.2,32.76 15.2,32.2 R108.2
N$21
  Top 0.203: R107.2 11.26,34.68
  Top 0.254: 11.26,34.68 D101.A
N$22
  Top 0.203: LED3.A 11.27,31.12 11.44,31.29 14.85,31.29 15.18,30.96 15.18,30.41 R106.2
N$23
  Top 0.125: 28,29.25 28.27,28.98 28.27,26.02
  Top 0.152: EDBG.C7 28,29.25 | R317.2 C302.1 28.27,26.02
N$24
  Top 0.127: C301.1 27.72,24.22
  Top 0.152: 26.51,20.62 29.01,20.62 29.34,20.96 29.34,22.97 28.63,23.67 28.43,23.67 C301.1 27.94,24.37 27.94,25.02 28.6,25.68 EDBG.A6
  Top 0.203: 26.51,20.62 X300.1
N$25
  Top 0.127: 29.25,27.88 29.22,27.88 28.97,27.62 28.97,25.57 29.17,25.37 30.37,25.37 30.76,24.98 30.76,24.59
  Top 0.152: EDBG.A5 29.25,27.88 | 30.76,24.59 30.76,24.2 C300.1 30.89,24.26
  Top 0.203: 30.76,24.2 30.76,23.46 X300.3
N$26
  Top 0.152: EDBG.E10 24.07,30.55 C306.1 C305.1
N$27
  Top 0.125: 28.32,33.37 28.32,35.34
  Top 0.127: 28.55,33.15 28.54,33.15 28.32,33.37 | 28.32,35.34 L301.2
  Top 0.152: EDBG.J6 28.55,33.15
  Top 0.203: C304.1 28.57,36.06 L301.2
N$34  (via drill 0.25 pad 0.45)
  Top 0.152: EDBG.K2 31.2,33.82 31.57,34.19 v33.15,34.19 | R311.1 39.78,34.8 39.78,35.51 v39.73,35.56
  Bottom 0.203: v33.15,34.19 33.15,34.21 34.49,35.56 v39.73,35.56
N$37  (via drill 0.2 pad 0.4, 0.25 pad 0.45)
  Top 0.152: EDBG.K3 30.49,33.8 v30.33,33.96
  Top 0.2: v43.74,39.65 R312.1
  Top 0.203: v30.05,41.33 36.4,41.33 37.46,40.26 v37.46,39.67
  Bottom 0.203: v30.33,33.96 30.05,34.24 v30.05,41.33 | v37.46,39.67 43.71,39.67 v43.74,39.65
N$38  (via drill 0.25 pad 0.45)
  Top 0.152: v35.26,34.87 35.26,34.9 34.19,35.97 32.92,35.97 30.86,33.91 30.86,33.5 30.79,33.43 30.18,33.43 EDBG.J4 | v42.34,35.59 R313.1
  Bottom 0.203: v35.26,34.87 35.36,34.77 41.53,34.77 v42.34,35.59
N$39  (via drill 0.2 pad 0.45, 0.25 pad 0.45)
  Top 0.125: 29.44,32.16 32.28,32.16 v32.33,32.21
  Top 0.152: EDBG.G5 29.25,31.97 29.44,32.16 | R314.1 v41.02,35.55 v41.03,35.56
  Bottom 0.203: v41.03,35.56 v41.02,35.57 41.02,36.17 41.17,36.32 42.85,36.32 43.23,35.94 43.23,35.2 42.27,34.24 34.67,34.24 32.64,32.21 v32.33,32.21
N$40  (via drill 0.2 pad 0.45, 0.25 pad 0.45)
  Top 0.152: EDBG.C9 26.65,29.24 v26.39,28.98 | R310.2 v58.78,35.03
  Bottom 0.203: v26.39,28.98 26.39,21.74 28.47,19.66 41.07,19.66 47.32,25.91 47.33,25.91 47.44,26.02 47.44,29.15 49.46,31.16 49.46,31.22 55.19,31.22 58.78,34.81 v58.78,35.03
N$41  (via drill 0.2 pad 0.45, 0.25 pad 0.45)
  Top 0.125: EDBG.C10 25.36,29.25
  Top 0.152: 25.36,29.25 v25.35,29.26 | v58.76,33.98 R309.2
  Bottom 0.203: v25.35,29.26 25.73,28.88 25.73,21.89 28.37,19.25 41.2,19.25 47.75,25.81 47.75,28.98 49.55,30.79 56.06,30.79 58.76,33.48 v58.76,33.98
N$42  (via drill 0.2 pad 0.45, 0.25 pad 0.45)
  Top 0.152: EDBG.D8 27.28,29.9 v27.05,29.67 | v27.69,21.72 v28.78,21.72
  Top 0.2: R308.2 40.63,30.7 v40.59,30.66
  Bottom 0.203: v40.59,30.66 40.59,31.04 40.74,31.19 43.31,31.19 44.4,30.1 46.57,30.1 47.12,29.55 47.12,28.48 46.79,28.14 46.79,26.29 45.39,24.89 44.66,24.89 43.67,23.9 43.67,23.73 40.51,20.57 29.08,20.57 28.78,20.88 v28.78,21.72 | v27.05,29.67 27.05,22.35 v27.69,21.72
N$43  (via drill 0.2 pad 0.45, 0.25 pad 0.45)
  Top 0.125: 27.3,31.25 27.03,31.52 25.4,31.52 v25.22,31.7
  Top 0.152: EDBG.F8 27.3,31.25 | 45.8,34.85 R307.2 48.56,32.19 v48.56,29.08
  Bottom 0.203: v25.22,31.7 25.22,29.79 24.87,29.44 24.87,22.05 28.12,18.8 41.22,18.8 48.36,25.93 48.36,28.88 v48.56,29.08
N$44  (via drill 0.2 pad 0.45, 0.25 pad 0.45)
  Top 0.152: EDBG.E9 v26.87,30.33
  Top 0.203: R306.2 44.83,24.33 v44.76,24.26
  Bottom 0.203: v44.76,24.26 40.59,20.09 28.85,20.09 28.25,20.7 28.25,30.07 27.99,30.33 v26.87,30.33
N$45  (via drill 0.2 pad 0.45, 0.25 pad 0.45)
  Top 0.152: EDBG.F9 26.71,31.2 v26.95,30.96
  Top 0.203: R305.2 45.04,25.24 v44.81,25.48
  Bottom 0.203: v26.95,30.96 28.22,30.96 28.93,30.25 28.93,23.01 29.72,22.23 29.72,21.11 29.84,20.98 40.31,20.98 v44.81,25.48
N$67
  Top 0.203: R301.1 D300.A
N$68
  Top 0.254: R302.1 14.87,26.25 14.3,25.68 12.49,25.68 D301.A
PA00_XIN32
  Top 0.2: 54.25,26.75 54.25,26.64 | C103.2
  Top 0.203: 54.25,26.75 54.25,28.28 IC2.1 | 54.25,26.64 55.52,25.37 56.62,25.37 56.89,25.65 C103.2 | XC100.2 57.94,25.11 C103.2
PA01_XOUT32
  Top 0.152: 58.07,27.26 J103.1 J103.2
  Top 0.2: 55.6,27.86 55.67,27.8
  Top 0.203: IC2.2 54.68,28.79 55.6,27.86 | 56.92,27.26 C104.2 | 56.92,27.26 58.07,27.26 | J103.2 58.8,25.54 58.8,23.07 XC100.1 | 56.92,27.26 56.92,27.62 56.74,27.8 55.67,27.8
PA02_AIN0
  Top 0.2: 54.71,29.29 54.78,29.29 | 50.82,2.56 J106.1
  Top 0.203: IC2.3 54.71,29.29 | 54.78,29.29 55.92,28.15 58.49,28.15 59.24,27.4 59.24,11.62 50.82,3.2 50.82,2.56
PA03_AREFA  (via drill 0.25 pad 0.45)
  Top 0.2: 55.83,28.8 55.78,28.85
  Top 0.203: 55.78,28.85 54.84,29.79 IC2.4 52.48,29.79 51.99,30.28 v51.99,33.91 | 26.4,44.93 24.87,44.93 23.88,45.92 J101.8 | C113.1 55.83,28.8
  Top 0.254: 26.4,44.93 C112.1
  Bottom 0.203: J101.8 23.88,51.77 24.3,52.19 | 24.3,52.19 24.51,52.4 | v51.99,33.91 51.99,38.61 54.63,41.25 54.63,51.84 54.08,52.4 54.07,52.4 53.92,52.55 24.66,52.55 24.3,52.19
PA04_AIN4
  Top 0.203: 58.55,2.54 J106.4 60.68,4.8 60.68,31.32 59.08,32.92 55.47,32.92 54.84,32.28 IC2.9 54.29,32.26
PA05_AIN5
  Top 0.203: 54.28,32.77 IC2.10 54.79,32.79 55.32,33.32 59.38,33.32 59.69,33.02 59.69,32.99 61.52,31.17 61.52,3.48 60.96,2.92 J106.5
PA08_TCC0-W0  (via drill 0.25 pad 0.45)
  Top 0.203: IC2.23 47.74,36.08 v47.6,36.22
  Bottom 0.203: v47.6,36.22 47.6,45.06 J102.5
PA09_TCC0-W1  (via drill 0.25 pad 0.45)
  Top 0.203: IC2.14 52.24,35.8 52.76,36.32 53.42,36.32 v53.67,36.07
  Bottom 0.203: v53.67,36.07 53.67,39.04 55.93,41.3 55.93,50.75 J102.4
PA10_TCC0-W2  (via drill 0.25 pad 0.45)
  Top 0.203: IC2.15 51.74,35.94 52.86,37.06 53.8,37.06 v54.79,36.07
  Bottom 0.203: J102.2 60.96,42.37 54.79,36.2 v54.79,36.07
PA11_TCC0-W3  (via drill 0.25 pad 0.45)
  Top 0.203: IC2.16 51.23,36.09 52.7,37.57 54.23,37.57 v55.73,36.07
  Bottom 0.203: J102.1 63.5,43.84 v55.73,36.07
PA14_TCC0-W4  (via drill 0.25 pad 0.45)
  Top 0.203: 54.19,35.31 v54.2,35.33
  Top 0.254: IC2.13 54.2,35.31 v54.2,35.33
  Bottom 0.203: v54.2,35.33 54.2,36.88 58.42,41.1 J102.3
PA15_TCC0-W5  (via drill 0.25 pad 0.45)
  Top 0.203: IC2.24 47.21,35.31 46.74,35.79 v46.74,36.2
  Bottom 0.203: v46.74,36.2 46.74,46.74 J102.6
PA20_TCC0-W6
  Top 0.2: 47.32,49.86 47.32,44.6 46.51,43.79 41.66,43.79 38.94,41.08 38.94,33.15 40.3,31.79 IC2.29
  Top 0.203: 47.32,49.86 J102.7
  Top 0.254: 48.23,50.77 J102.7
PA27_TX_LED  (via drill 0.25 pad 0.45)
  Top 0.2: 33.17,22.4 33.17,23.2 33.17,23.21 | 48.09,26.17 48.13,26.21
  Top 0.203: IC2.39 48.24,26.32 48.13,26.21 | 33.17,22.4 33.17,20.27 32.05,19.15 v13.87,19.15 | 48.09,26.17 48.09,24.33 47.34,23.57 44.72,23.57 42.74,25.55 33.84,25.55 33.17,24.87 33.17,23.21 | v14.42,32.24 13.37,32.24 D102.C
  Bottom 0.203: v14.42,32.24 14.2,32.21 13.87,31.88 v13.87,19.15
PA28_USB_HOST_EN  (via drill 0.25 pad 0.45)
  Top 0.203: R113.2 v15.13,35.97 v15.14,35.97 | IC2.41 49.24,27.9 49.35,28.02 v50.24,28.02
  Bottom 0.203: v15.14,35.97 15.14,35.94 13.28,34.09 13.28,18.39 13.59,18.09 41.12,18.09 48.56,25.52 48.67,25.52 50.24,27.1 v50.24,28.02
PA30_SWCLK
  Top 0.2: R104.1 53.05,21.33 53.74,22.02 | 53.74,24.13 53.75,24.13
  Top 0.203: IC2.45 51.24,26.13 52.17,25.2 52.85,25.2 53.75,24.3 53.75,24.13 | 53.74,22.02 53.74,24.13
PA31_SWDIO
  Top 0.2: IC2.46 51.74,26.23 52.32,25.65
  Top 0.203: 50.01,20.09 R105.2 53.39,20.37 54.32,21.3 | 52.32,25.65 53.17,25.65 54.32,24.5 54.32,21.3 | 54.32,21.3
PB02_AIN10  (via drill 0.25 pad 0.45)
  Top 0.203: v63.5,12.65 J106.6 | v58.67,12.7 58.67,18.72 55.65,21.74 55.65,24.69 54.28,26.06 52.45,26.06 52.24,26.28 IC2.47
  Bottom 0.203: v58.67,12.7 v63.5,12.65
PB03_RX_LED  (via drill 0.25 pad 0.45)
  Top 0.2: 47.62,28.55 47.22,28.55 45.52,26.85 34.52,26.85 | 32.74,22.81 32.74,25.07
  Top 0.203: IC2.48 52.74,27.33 51.51,28.55 47.62,28.55 | 32.74,22.81 32.74,20.45 31.95,19.66 14.7,19.66 v14.62,19.74 | 34.52,26.85 32.74,25.07 | v14.32,33.88 13.37,33.88 D101.C
  Bottom 0.203: v14.62,19.74 14.62,33.58 v14.32,33.88
PB08_AIN2
  Top 0.2: 59.77,30.78 59.61,30.94 | J106.2
  Top 0.203: 59.61,30.94 58.45,32.11 55.65,32.11 54.84,31.29 IC2.7 54.28,31.27 | 59.77,30.78 59.77,28.87 59.61,28.72 59.61,9.37 53.34,3.1 J106.2
PB09_AIN3
  Top 0.2: 55.89,2.55 J106.3
  Top 0.203: IC2.8 54.27,31.8 54.91,31.8 55.63,32.51 58.73,32.51 60.15,31.09 60.15,7.33 55.89,3.07 55.89,2.55
  Top 0.254: 55.93,2.59 J106.3
PB10_S4_SPI_MOSI
  Top 0.203: 66.17,27.76 65.23,26.82 62.38,26.82 61.98,27.23 61.98,32.66 56.57,38.07 49.73,38.07 49.12,37.46 49.12,36.52 49.68,35.96 49.68,35.37
  Top 0.254: ICSP.4 66.17,27.76 | 49.68,35.37 IC2.19
PB11_S4_SPI_SCK
  Top 0.203: ICSP.3 62.76,27.94 62.43,28.27 62.43,33.02 56.85,38.61 49.68,38.61 48.72,37.64 48.72,36.35 49.2,35.86 49.2,35.35
  Top 0.254: 49.2,35.35 IC2.20
PB12_S4_SPI_MISO
  Top 0.203: IC2.21 48.74,35.74 48.28,36.19 48.28,37.97 49.4,39.09 57.28,39.09 63.68,32.69 63.68,30.53
  Top 0.254: 63.68,30.53 ICSP.1
POWER_LED_CTRL  (via drill 0.2 pad 0.4, 0.25 pad 0.45)
  Top 0.152: 18.24,25.03 v18.24,25.76 | EDBG.K4 29.9,34.19 30.05,34.34 30.66,34.34 v31.01,34.7
  Top 0.203: 18.24,25.03 R300.1 | Q300.2 18.18,27.86 v18.38,28.06
  Bottom 0.203: v18.24,25.76 17.8,25.76 17.53,26.04 17.53,26.92 | 17.53,26.92 17.53,44.53 18.34,45.34 28.42,45.34 31.01,42.75 v31.01,34.7 | v18.38,28.06 17.65,27.05 17.53,26.92
RXD
  Top 0.203: IC2.38 47.74,24.71 47.36,24.33 R306.1
SAMD21_RESET  (via drill 0.25 pad 0.45)
  Top 0.125: EDBG.B4 29.9,28.54 30.22,28.22 33.92,28.22 v33.94,28.25
  Top 0.2: 44.49,23.12 47.39,23.12 48.51,24.25 48.51,23.93 | 49.97,22.47 49.97,22.3 R103.1
  Top 0.203: IC2.40 48.74,25.77 48.51,25.55 48.51,24.25 | 44.49,23.12 42.57,25.05 34.34,25.05 33.94,24.65 v33.94,24.42 | 49.97,22.47 48.51,23.93
  Bottom 0.203: v33.94,28.25 v33.94,24.42
SCK  (via drill 0.25 pad 0.45)
  Top 0.2: 42.17,33.77 42.17,33.22 42.32,33.07 42.87,33.07 43.02,33.22 | 45.68,33.32 44.57,33.32 44.32,33.07 43.17,33.07 43.02,33.22 | v43.02,41.02 43.02,33.22
  Top 0.203: v17.09,35.13 18.5,35.13 R109.1 18.52,33.85 20.04,32.33 TR3.3 | 42.17,33.77 R313.2 | 45.68,33.32 IC2.26 | v43.02,41.02 v43.03,41.02
  Top 0.254: 45.7,33.28 IC2.26 | 42.44,33.78 R313.2
  Bottom 0.203: J101.6 28.96,46.79 | 28.96,46.79 28.88,46.71 28.88,46.68 28.09,45.9 18.14,45.9 16.87,44.63 16.87,35.35 v17.09,35.13 | 28.96,46.79 28.96,46.68 35.28,40.36 42.57,40.36 43.03,40.82 v43.03,41.02
SCL  (via drill 0.2 pad 0.45, 0.25 pad 0.45)
  Top 0.125: EDBG.F7 v27.62,31.53
  Top 0.203: v47.32,30.1 47.12,30.29 IC2.32 | R112.1 29.06,43.13 | 29.06,43.13 28.57,43.61 28.57,45.67 27.71,46.53 27.71,51.69 26.44,52.96 19.94,52.96 18.8,51.82 J101.10 | 29.06,43.13 28.98,43.13 v28.8,42.95
  Bottom 0.203: v47.32,30.1 46.93,30.48 44.67,30.48 43.56,31.6 38.15,31.6 37.73,32.02 33.62,32.02 32.97,31.37 30.1,31.37 29.44,32.03 28.65,32.03 28.14,31.53 v27.62,31.53 27.58,31.57 27.08,31.57 27.03,31.62 27.03,32.23 28.4,33.6 28.52,33.72 28.52,34.73 27,36.25 27,42.21 27.74,42.95 v28.8,42.95
SDA  (via drill 0.2 pad 0.45, 0.25, 0.25 pad 0.45)
  Top 0.125: EDBG.G7 v27.62,32.17
  Top 0.2: 25.12,52.09 25.12,52.15 24.74,52.52
  Top 0.203: IC2.31 45.76,30.75 46.93,30.75 v47.32,31.14 | R111.1 28,42.16 v27.94,42.16 27.66,42.44 27.66,45.21 26.9,45.97 25.48,45.97 25.12,46.33 25.12,52.09 | 24.74,52.52 21.66,52.52 21.34,52.2 J101.9
  Bottom 0.203: v47.32,31.14 47.19,31.01 44.84,31.01 43.81,32.03 38.43,32.03 37.95,32.51 33.5,32.51 32.74,31.75 30.48,31.75 29.82,32.41 28.35,32.41 28.11,32.17 v27.62,32.17 28.91,33.45 28.91,35.13 27.86,36.17 27.86,42.09 v27.94,42.16
SS  (via drill 0.25 pad 0.45)
  Top 0.2: v41.67,42.44 41.67,33.97 41.48,33.78 R314.2 42.13,32.67 45.14,32.67 45.26,32.79 IC2.27
  Bottom 0.203: J101.3 36.55,50.77 36.55,47.56 v41.67,42.44
STATUS_LED_CTRL  (via drill 0.2 pad 0.45, 0.25 pad 0.45)
  Top 0.125: 33.02,32.38 33.02,32.41 v32.59,32.84
  Top 0.152: EDBG.F1 32.11,31.2 33.02,32.11 33.02,32.38 | v20.5,28.78 R304.2
  Top 0.203: Q300.5 20.38,27.86 R304.2
  Bottom 0.203: 31.6,33.45 31.98,33.45 v32.59,32.84 | v20.5,28.78 20.5,28.8 17.93,31.37 17.93,44.22 18.56,44.85 27.92,44.85 28.04,44.73 30.62,42.15 30.62,41.15 30.5,41.03 30.5,34.44 31.5,33.45 | 31.6,33.45 31.59,33.45 | 31.6,33.45 31.5,33.45 | 31.5,33.45 31.49,33.45
SW
  pour Top: 40.14,14.6 30.77,14.6 30.74,14.62 30.74,13.95 30.72,13.92 30.72,13.9 30.74,13.9 30.67,13.82 30.19,13.37 27.64,13.37 27.62,13.35 27.62,11.72 27.59,11.7 33.17,11.7 35.67,9.2 40.12,9.2 40.19,9.22 40.19,14.55
SWCLK  (via drill 0.25 pad 0.45)
  Top 0.125: 28.6,30 28.78,30.18 30.76,30.18 | v34.85,29.19 33.65,29.19 33.3,29.54
  Top 0.127: EDBG.D6 28.6,30 | 30.76,30.18 30.89,30.05 30.89,29.62 30.96,29.54 33.3,29.54
  Top 0.2: 34.84,24.2 35.09,23.95 | R104.2 48.99,21.35 v47.99,21.35 47.97,21.37
  Top 0.203: v34.84,24.22 34.84,24.2 | 35.09,23.95 42.54,23.95 45.12,21.37 47.97,21.37
  Bottom 0.203: 65.85,19.27 J100.4 66.12,19.27 66.42,19.57 66.42,21.47 66.27,21.62 66.27,21.64 65.53,22.38 61.77,22.38 61.72,22.38 60.69,21.35 v47.99,21.35 | v34.85,29.19 34.85,24.4 | 34.85,24.4 34.84,24.4 | 34.85,24.4 v34.85,24.23 v34.84,24.22
SWDIO  (via drill 0.25 pad 0.45)
  Top 0.152: EDBG.C5 29.25,29.2 29.54,28.91 33.22,28.91 v33.25,28.88
  Top 0.203: R105.1 48.93,20.07 v48.06,20.07 47.25,20.87 45.04,20.87 42.52,23.4 34.19,23.4 33.92,23.67 v33.92,23.7
  Bottom 0.203: J100.2 65.53,21.44 65.28,21.69 62.41,21.69 60.78,20.07 v48.06,20.07 | v33.92,23.7 33.44,23.7 33.22,23.92 33.22,28.85 v33.25,28.88
TARGET_RESET  (via drill 0.25 pad 0.45)
  Top 0.2: 48.98,22.11 R103.2 48.79,22.3 v48.12,22.96 47.46,22.3 R101.2
  Top 0.203: R100.1 12.32,48.15 R102.2 v12.29,49.35 C101.1
  Top 0.254: 47.57,22.16 R101.2
  Bottom 0.203: J105.3 33.02,8.38 | 33.02,8.38 33.02,8.5 47.59,23.07 48.01,23.07 v48.12,22.96 61.16,22.96 63.6,25.4 ICSP.5 63.63,25.38 66.88,22.12 66.88,15.95 66.37,15.44 65.55,15.44 J100.10 | v12.29,49.35 12.29,49.22 11.99,48.92 11.99,41.71 14.71,38.99 14.69,38.98 14.69,36.3 12.54,34.15 12.54,34.1 12.55,34.09 12.55,17.63 13.16,17.02 24.38,17.02 33.02,8.38
TARGET_RESET_SENSE  (via drill 0.25 pad 0.45)
  Top 0.125: EDBG.H2 31.54,32.84 32.04,32.84 32.17,32.97 32.17,33.27 32.27,33.37 33.07,33.37 35.02,31.42 35.02,30.82 35.77,30.07 v35.77,28.25
  Top 0.152: EDBG.H2 31.23,32.5 | 46.16,22.1 R101.1
  Top 0.2: v35.77,24.47 42.62,24.47 | 46.28,22.35 R101.1
  Top 0.203: 42.62,24.47 44.74,22.35 46.28,22.35
  Bottom 0.203: v35.77,28.25 v35.77,24.47
TARGET_USB_N
  Top 0.102: D103.3 9,39.47
  Top 0.152: 45.7,29.74 39.83,29.74 arc-90 36.77,33.24 36.77,37.18 arc92 34.22,39.84 18.27,39.84 arc31 16.39,39.39 15.97,38.97 arc-45 15.26,38.67 9.79,38.67 9,39.47 | J107.D- 8.24,38.75 D103.3
  Top 0.203: IC2.33 45.71,29.74 45.7,29.74
TARGET_USB_P
  Top 0.102: D103.2 8.99,37.27
  Top 0.152: 19.28,39.39 19.82,39.39 | 19.82,39.39 34.22,39.39 arc-90 36.3,36.98 36.3,32.93 arc90 40.08,29.33 45.7,29.33 | 19.82,39.39 18.07,39.39 arc30 16.72,39.06 16.02,38.36 arc-45 15.31,38.07 9.79,38.07 8.99,37.27 | J107.D+ 8.22,38.1 8.96,37.36
  Top 0.203: 45.7,29.33 IC2.34 | D103.2 8.96,37.36
TXD
  Top 0.203: IC2.37 47.24,25.65 R305.1
USB_HOST_ENABLE  (via drill 0.25 pad 0.45)
  Top 0.203: v14.17,36.91 13.53,36.91 | 14.33,36.91 v14.17,36.91 | R210.2 R113.1 | Q203.1 14.19,36.89 v14.17,36.91
  Top 0.254: J107.ID 5.75,37.45 v5.77,37.46 | 13.53,36.91 R113.1
  Bottom 0.203: v5.77,37.46 5.84,37.46 6.4,36.91 v14.17,36.91
VCC_EDBG_3V3  (via drill 0.2 pad 0.45, 0.25 pad 0.45)
  Top 0.125: EDBG.F6 v28.93,31.53 | EDBG.E5 v29.57,30.88 | EDBG.D9 EDBG.D10 v24.36,29.9
  Top 0.127: EDBG.B6 EDBG.B5 | 29.62,25.99 C311.1 29.59,26.06 29.59,26.76 v29.62,26.79 29.59,26.81 29.59,28.3 | EDBG.J5 29.3,33.15 29.57,33.42 29.57,34.72 v29.54,34.75 29.98,35.19
  Top 0.152: 23.61,29.9 C310.1 | C309.1 23.54,29.84 C310.1 | C314.1 C313.1 | EDBG.J5 29.25,33.11 | v28.93,31.53 | C313.1 29.98,35.29 | C313.1 29.98,35.19 | EDBG.B5 29.29,28.6 29.59,28.3 | v24.36,29.9 24.32,29.86 C310.1 | EDBG.F2 31.2,31.11 31.45,30.86 v32.56,30.86 32.57,30.85 33.1,30.85 C312.1
  Top 0.203: L301.1 29.1,37.43 C314.1 | C315.1 C312.1 | R319.2 40.34,27.59 v39.93,27.58 | v16.85,28.61 16.18,28.61 R301.2
  Top 0.254: R300.2 v15.88,24.94 15.87,24.95 R302.2
  Power 0.152: v29.54,34.75 29.84,34.75 29.9,34.7 | v29.62,26.79 29.62,26.57 29.64,26.59 | v24.36,29.9 24.36,29.79 24.33,29.77 | v32.56,30.86 32.56,30.58 32.61,30.53
  Power 0.203: v16.85,28.61 15.88,29.77 | v39.93,27.58 39.73,27.58 39.83,27.64
  Power 0.254: v15.88,24.94 15.7,24.94
  pour Power: 20.17,44.72 40.27,44.72 40.27,20.32 13.72,20.32 13.72,30.92 20.22,30.92
VCC_EDBG_USB  (via drill 0.25, 0.25 pad 0.45)
  Top 0.152: 10.11,24.84 10.95,24 19.28,24 23.24,27.96 25.98,27.96
  Top 0.203: v10.11,16.31 10.11,15.95 Q200.3 | R208.2 15.1,45.55 Q201.1 14.5,45.27 13.6,46.17 11.42,46.17 9.49,44.24 9.49,42.22 8.4,41.13 7.44,41.13 v7.15,40.84
  Top 0.254: v10.11,24.97 10.11,24.84 | 25.98,27.96 EDBG.A10 | v4.52,30.56 F300.2
  Bottom 0.203: v10.11,16.31 v10.11,24.97 v4.52,30.56 3.7,31.38 3.7,39.78 4.76,40.84 v7.15,40.84
VCC_EXT_VIN  (via drill 0.25 pad 0.45)
  Top 0.254: 26.98,10.61 R200.1
  Top 0.61: v28.83,10.59 v28.2,10.59 R200.1 | U200.5 26.98,10.61
  Top 0.762: J105.8 45.72,1.52 44.83,0.64 26.54,0.64 25.53,1.65 25.53,4.06 25.02,4.57 23.72,4.57
  Top 0.813: 23.72,4.57 L200.2 22.72,4.52 22.07,5.17 v22.07,5.57 v22.07,6.42 22.07,8.72 C203.+ 22.05,8.71 22.05,8.68 | 22.02,8.47 22.02,8.51 22.05,8.54 22.05,8.68 | 22.05,8.68 22.15,8.78
  Bottom 0.203: 28.81,10.57 v28.83,10.59
  Bottom 0.813: 28.81,10.57 24.12,10.57 22.07,8.52 v22.07,6.42 v22.07,5.57
VDDCORE
  Top 0.2: IC2.43 50.24,25.52 C102.1
VEXT  (via drill 0.25 pad 0.45)
  Top 0.254: R205.2 6.25,12.95 v6.27,12.93
  Top 0.914: D201.A 17.02,3.67 17.02,4.37 15.14,6.25 12.39,6.25 11.72,6.92 11.72,8.27 J200.2
  Bottom 0.203: v6.27,12.93 6.27,12.9 10.87,8.31 J200.2
VIN_DETECT
  Top 0.203: R206.2 6.22,15.13 R205.1 7.03,15.1 Q200.1
XVCC
  Top 0.254: C307.1 L300.1 7.06,26.28 D302.4
  Top 0.406: J300.VBUS 6.96,23.53 D302.4

## Text on the board
tPlace: #13 | #12 | 11 | 10 | 9 | #8 | 7 | 6 | 5 | #4 | 3 | 2 | 1 | 0
tNames: SCL | SDA | AREF | GND | # | # | # | # | # | # | DIGITAL | TX | RX | 1 | ANALOG IN | IOREF | RESET | 3V3 | 5V | GND | VIN | A0 | A1 | A2 | A3 | A4 | A5
214bmp: D:/SmartProjects/Snc/a4_bn_logo2.bmp